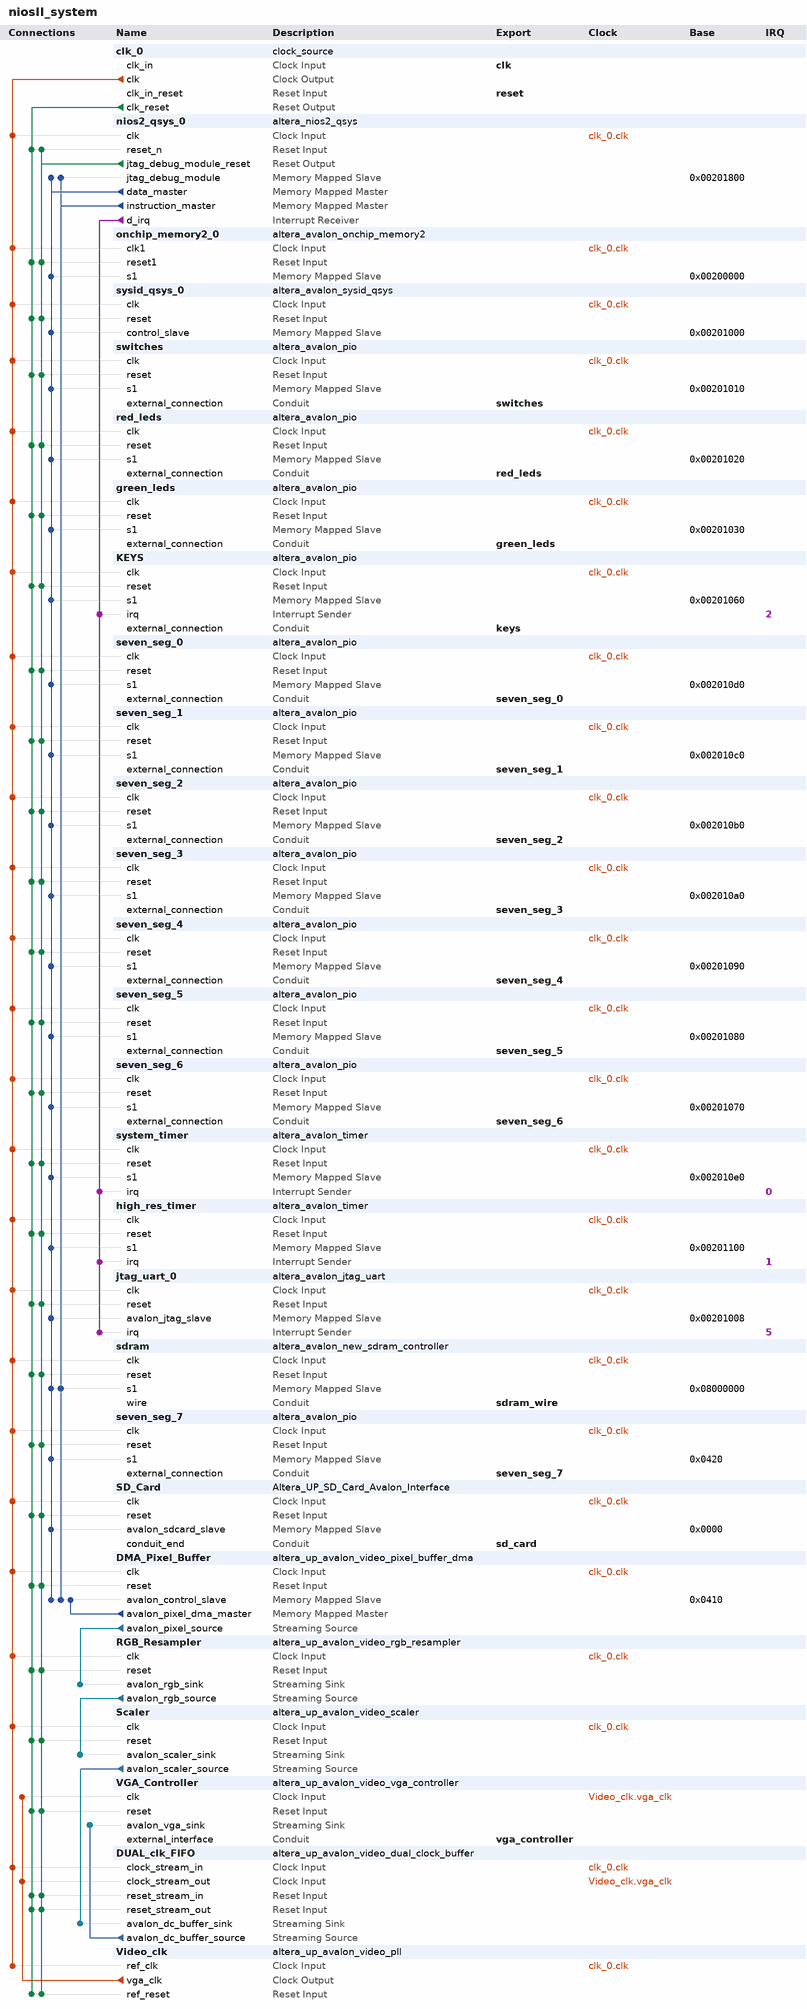
[diagram p0: system contents]
# Platform Designer (Qsys) system niosII_system, Cyclone IV E EP4CE115F29C7
# Parameters at their usual value, and those the tool derives, are not listed.
package require -exact qsys 16.1
create_system niosII_system
set_project_property DEVICE_FAMILY {Cyclone IV E}
set_project_property DEVICE EP4CE115F29C7

add_instance clk_0 clock_source 16.1
set_instance_parameter_value clk_0 clockFrequency 50000000

add_instance nios2_qsys_0 altera_nios2_qsys 16.1
set_instance_parameter_value nios2_qsys_0 breakSlave nios2_qsys_0.jtag_debug_module
set_instance_parameter_value nios2_qsys_0 exceptionSlave sdram.s1
set_instance_parameter_value nios2_qsys_0 icache_size 4096
set_instance_parameter_value nios2_qsys_0 impl Fast
set_instance_parameter_value nios2_qsys_0 mmu_TLBMissExcSlave None
set_instance_parameter_value nios2_qsys_0 resetSlave sdram.s1
set_instance_parameter_value nios2_qsys_0 resetrequest_enabled true

add_instance onchip_memory2_0 altera_avalon_onchip_memory2 16.1
set_instance_parameter_value onchip_memory2_0 dataWidth 32
set_instance_parameter_value onchip_memory2_0 dualPort false
set_instance_parameter_value onchip_memory2_0 initMemContent true
set_instance_parameter_value onchip_memory2_0 initializationFileName onchip_mem.hex
set_instance_parameter_value onchip_memory2_0 memorySize 4096

add_instance sysid_qsys_0 altera_avalon_sysid_qsys 16.1
set_instance_parameter_value sysid_qsys_0 id 16843008

add_instance switches altera_avalon_pio 16.1
set_instance_parameter_value switches direction Input
set_instance_parameter_value switches width 18

add_instance red_leds altera_avalon_pio 16.1
set_instance_parameter_value red_leds direction Output
set_instance_parameter_value red_leds width 18

add_instance green_leds altera_avalon_pio 16.1
set_instance_parameter_value green_leds direction Output
set_instance_parameter_value green_leds width 8

add_instance KEYS altera_avalon_pio 16.1
set_instance_parameter_value KEYS captureEdge true
set_instance_parameter_value KEYS direction Input
set_instance_parameter_value KEYS edgeType FALLING
set_instance_parameter_value KEYS generateIRQ true
set_instance_parameter_value KEYS irqType EDGE
set_instance_parameter_value KEYS width 3

add_instance seven_seg_0 altera_avalon_pio 16.1
set_instance_parameter_value seven_seg_0 direction Output
set_instance_parameter_value seven_seg_0 width 7

add_instance seven_seg_1 altera_avalon_pio 16.1
set_instance_parameter_value seven_seg_1 direction Output
set_instance_parameter_value seven_seg_1 width 7

add_instance seven_seg_2 altera_avalon_pio 16.1
set_instance_parameter_value seven_seg_2 direction Output
set_instance_parameter_value seven_seg_2 width 7

add_instance seven_seg_3 altera_avalon_pio 16.1
set_instance_parameter_value seven_seg_3 direction Output
set_instance_parameter_value seven_seg_3 width 7

add_instance seven_seg_4 altera_avalon_pio 16.1
set_instance_parameter_value seven_seg_4 direction Output
set_instance_parameter_value seven_seg_4 width 7

add_instance seven_seg_5 altera_avalon_pio 16.1
set_instance_parameter_value seven_seg_5 direction Output
set_instance_parameter_value seven_seg_5 width 7

add_instance seven_seg_6 altera_avalon_pio 16.1
set_instance_parameter_value seven_seg_6 direction Output
set_instance_parameter_value seven_seg_6 width 7

add_instance system_timer altera_avalon_timer 16.1
set_instance_parameter_value system_timer period 1
set_instance_parameter_value system_timer periodUnits MSEC

add_instance high_res_timer altera_avalon_timer 16.1
set_instance_parameter_value high_res_timer period 1
set_instance_parameter_value high_res_timer periodUnits USEC

add_instance jtag_uart_0 altera_avalon_jtag_uart 16.1
set_instance_parameter_value jtag_uart_0 simInteractiveOptions NO_INTERACTIVE_WINDOWS

add_instance sdram altera_avalon_new_sdram_controller 16.1
set_instance_parameter_value sdram TAC 5.4
set_instance_parameter_value sdram TRCD 15.0
set_instance_parameter_value sdram TRP 15.0
set_instance_parameter_value sdram casLatency 3
set_instance_parameter_value sdram columnWidth 10
set_instance_parameter_value sdram dataWidth 32
set_instance_parameter_value sdram generateSimulationModel false
set_instance_parameter_value sdram model single_Micron_MT48LC4M32B2_7_chip
set_instance_parameter_value sdram numberOfBanks 4
set_instance_parameter_value sdram numberOfChipSelects 1
set_instance_parameter_value sdram powerUpDelay 100.0
set_instance_parameter_value sdram refreshPeriod 7.8125
set_instance_parameter_value sdram rowWidth 13

add_instance seven_seg_7 altera_avalon_pio 16.1
set_instance_parameter_value seven_seg_7 direction Output
set_instance_parameter_value seven_seg_7 width 7

add_instance SD_Card Altera_UP_SD_Card_Avalon_Interface 16.1

add_instance DMA_Pixel_Buffer altera_up_avalon_video_pixel_buffer_dma 16.1
set_instance_parameter_value DMA_Pixel_Buffer addr_mode X-Y
set_instance_parameter_value DMA_Pixel_Buffer back_start_address 0
set_instance_parameter_value DMA_Pixel_Buffer color_space {16-bit RGB}
set_instance_parameter_value DMA_Pixel_Buffer image_height 240
set_instance_parameter_value DMA_Pixel_Buffer image_width 320
set_instance_parameter_value DMA_Pixel_Buffer start_address 0

add_instance RGB_Resampler altera_up_avalon_video_rgb_resampler 16.1
set_instance_parameter_value RGB_Resampler alpha 1023
set_instance_parameter_value RGB_Resampler input_type {16-bit RGB}
set_instance_parameter_value RGB_Resampler output_type {30-bit RGB}

add_instance Scaler altera_up_avalon_video_scaler 16.1
set_instance_parameter_value Scaler color_bits 10
set_instance_parameter_value Scaler color_planes 3
set_instance_parameter_value Scaler height_scaling 2
set_instance_parameter_value Scaler width_in 320
set_instance_parameter_value Scaler width_scaling 2

add_instance VGA_Controller altera_up_avalon_video_vga_controller 16.1
set_instance_parameter_value VGA_Controller board DE2-115
set_instance_parameter_value VGA_Controller resolution {VGA 640x480}

add_instance DUAL_clk_FIFO altera_up_avalon_video_dual_clock_buffer 16.1
set_instance_parameter_value DUAL_clk_FIFO color_bits 10

add_instance Video_clk altera_up_avalon_video_pll 16.1
set_instance_parameter_value Video_clk camera {5MP Digital Camera}
set_instance_parameter_value Video_clk gui_refclk 50.0
set_instance_parameter_value Video_clk lcd {7" LCD on VEEK-MT and MTL Module}

# connections
add_connection clk_0.clk DMA_Pixel_Buffer.clk clock
add_connection clk_0.clk DUAL_clk_FIFO.clock_stream_in clock
add_connection clk_0.clk green_leds.clk clock
add_connection clk_0.clk high_res_timer.clk clock
add_connection clk_0.clk jtag_uart_0.clk clock
add_connection clk_0.clk KEYS.clk clock
add_connection clk_0.clk nios2_qsys_0.clk clock
add_connection clk_0.clk onchip_memory2_0.clk1 clock
add_connection clk_0.clk red_leds.clk clock
add_connection clk_0.clk RGB_Resampler.clk clock
add_connection clk_0.clk Scaler.clk clock
add_connection clk_0.clk SD_Card.clk clock
add_connection clk_0.clk sdram.clk clock
add_connection clk_0.clk seven_seg_0.clk clock
add_connection clk_0.clk seven_seg_1.clk clock
add_connection clk_0.clk seven_seg_2.clk clock
add_connection clk_0.clk seven_seg_3.clk clock
add_connection clk_0.clk seven_seg_4.clk clock
add_connection clk_0.clk seven_seg_5.clk clock
add_connection clk_0.clk seven_seg_6.clk clock
add_connection clk_0.clk seven_seg_7.clk clock
add_connection clk_0.clk switches.clk clock
add_connection clk_0.clk sysid_qsys_0.clk clock
add_connection clk_0.clk system_timer.clk clock
add_connection clk_0.clk Video_clk.ref_clk clock
add_connection Video_clk.vga_clk DUAL_clk_FIFO.clock_stream_out clock
add_connection Video_clk.vga_clk VGA_Controller.clk clock
add_connection clk_0.clk_reset DMA_Pixel_Buffer.reset reset
add_connection clk_0.clk_reset DUAL_clk_FIFO.reset_stream_in reset
add_connection clk_0.clk_reset DUAL_clk_FIFO.reset_stream_out reset
add_connection clk_0.clk_reset green_leds.reset reset
add_connection clk_0.clk_reset high_res_timer.reset reset
add_connection clk_0.clk_reset jtag_uart_0.reset reset
add_connection clk_0.clk_reset KEYS.reset reset
add_connection clk_0.clk_reset nios2_qsys_0.reset_n reset
add_connection clk_0.clk_reset onchip_memory2_0.reset1 reset
add_connection clk_0.clk_reset red_leds.reset reset
add_connection clk_0.clk_reset RGB_Resampler.reset reset
add_connection clk_0.clk_reset Scaler.reset reset
add_connection clk_0.clk_reset SD_Card.reset reset
add_connection clk_0.clk_reset sdram.reset reset
add_connection clk_0.clk_reset seven_seg_0.reset reset
add_connection clk_0.clk_reset seven_seg_1.reset reset
add_connection clk_0.clk_reset seven_seg_2.reset reset
add_connection clk_0.clk_reset seven_seg_3.reset reset
add_connection clk_0.clk_reset seven_seg_4.reset reset
add_connection clk_0.clk_reset seven_seg_5.reset reset
add_connection clk_0.clk_reset seven_seg_6.reset reset
add_connection clk_0.clk_reset seven_seg_7.reset reset
add_connection clk_0.clk_reset switches.reset reset
add_connection clk_0.clk_reset sysid_qsys_0.reset reset
add_connection clk_0.clk_reset system_timer.reset reset
add_connection clk_0.clk_reset VGA_Controller.reset reset
add_connection clk_0.clk_reset Video_clk.ref_reset reset
add_connection nios2_qsys_0.jtag_debug_module_reset DMA_Pixel_Buffer.reset reset
add_connection nios2_qsys_0.jtag_debug_module_reset DUAL_clk_FIFO.reset_stream_in reset
add_connection nios2_qsys_0.jtag_debug_module_reset DUAL_clk_FIFO.reset_stream_out reset
add_connection nios2_qsys_0.jtag_debug_module_reset green_leds.reset reset
add_connection nios2_qsys_0.jtag_debug_module_reset high_res_timer.reset reset
add_connection nios2_qsys_0.jtag_debug_module_reset jtag_uart_0.reset reset
add_connection nios2_qsys_0.jtag_debug_module_reset KEYS.reset reset
add_connection nios2_qsys_0.jtag_debug_module_reset nios2_qsys_0.reset_n reset
add_connection nios2_qsys_0.jtag_debug_module_reset onchip_memory2_0.reset1 reset
add_connection nios2_qsys_0.jtag_debug_module_reset red_leds.reset reset
add_connection nios2_qsys_0.jtag_debug_module_reset RGB_Resampler.reset reset
add_connection nios2_qsys_0.jtag_debug_module_reset Scaler.reset reset
add_connection nios2_qsys_0.jtag_debug_module_reset SD_Card.reset reset
add_connection nios2_qsys_0.jtag_debug_module_reset sdram.reset reset
add_connection nios2_qsys_0.jtag_debug_module_reset seven_seg_0.reset reset
add_connection nios2_qsys_0.jtag_debug_module_reset seven_seg_1.reset reset
add_connection nios2_qsys_0.jtag_debug_module_reset seven_seg_2.reset reset
add_connection nios2_qsys_0.jtag_debug_module_reset seven_seg_3.reset reset
add_connection nios2_qsys_0.jtag_debug_module_reset seven_seg_4.reset reset
add_connection nios2_qsys_0.jtag_debug_module_reset seven_seg_5.reset reset
add_connection nios2_qsys_0.jtag_debug_module_reset seven_seg_6.reset reset
add_connection nios2_qsys_0.jtag_debug_module_reset seven_seg_7.reset reset
add_connection nios2_qsys_0.jtag_debug_module_reset switches.reset reset
add_connection nios2_qsys_0.jtag_debug_module_reset sysid_qsys_0.reset reset
add_connection nios2_qsys_0.jtag_debug_module_reset system_timer.reset reset
add_connection nios2_qsys_0.jtag_debug_module_reset VGA_Controller.reset reset
add_connection nios2_qsys_0.jtag_debug_module_reset Video_clk.ref_reset reset
add_connection DMA_Pixel_Buffer.avalon_pixel_dma_master DMA_Pixel_Buffer.avalon_control_slave avalon
set_connection_parameter_value DMA_Pixel_Buffer.avalon_pixel_dma_master/DMA_Pixel_Buffer.avalon_control_slave baseAddress 0x0410
add_connection nios2_qsys_0.data_master DMA_Pixel_Buffer.avalon_control_slave avalon
set_connection_parameter_value nios2_qsys_0.data_master/DMA_Pixel_Buffer.avalon_control_slave baseAddress 0x0410
add_connection nios2_qsys_0.data_master green_leds.s1 avalon
set_connection_parameter_value nios2_qsys_0.data_master/green_leds.s1 baseAddress 0x00201030
add_connection nios2_qsys_0.data_master high_res_timer.s1 avalon
set_connection_parameter_value nios2_qsys_0.data_master/high_res_timer.s1 baseAddress 0x00201100
add_connection nios2_qsys_0.data_master jtag_uart_0.avalon_jtag_slave avalon
set_connection_parameter_value nios2_qsys_0.data_master/jtag_uart_0.avalon_jtag_slave baseAddress 0x00201008
add_connection nios2_qsys_0.data_master KEYS.s1 avalon
set_connection_parameter_value nios2_qsys_0.data_master/KEYS.s1 baseAddress 0x00201060
add_connection nios2_qsys_0.data_master nios2_qsys_0.jtag_debug_module avalon
set_connection_parameter_value nios2_qsys_0.data_master/nios2_qsys_0.jtag_debug_module baseAddress 0x00201800
add_connection nios2_qsys_0.data_master onchip_memory2_0.s1 avalon
set_connection_parameter_value nios2_qsys_0.data_master/onchip_memory2_0.s1 baseAddress 0x00200000
add_connection nios2_qsys_0.data_master red_leds.s1 avalon
set_connection_parameter_value nios2_qsys_0.data_master/red_leds.s1 baseAddress 0x00201020
add_connection nios2_qsys_0.data_master SD_Card.avalon_sdcard_slave avalon
set_connection_parameter_value nios2_qsys_0.data_master/SD_Card.avalon_sdcard_slave baseAddress 0x0000
add_connection nios2_qsys_0.data_master sdram.s1 avalon
set_connection_parameter_value nios2_qsys_0.data_master/sdram.s1 baseAddress 0x08000000
add_connection nios2_qsys_0.data_master seven_seg_0.s1 avalon
set_connection_parameter_value nios2_qsys_0.data_master/seven_seg_0.s1 baseAddress 0x002010d0
add_connection nios2_qsys_0.data_master seven_seg_1.s1 avalon
set_connection_parameter_value nios2_qsys_0.data_master/seven_seg_1.s1 baseAddress 0x002010c0
add_connection nios2_qsys_0.data_master seven_seg_2.s1 avalon
set_connection_parameter_value nios2_qsys_0.data_master/seven_seg_2.s1 baseAddress 0x002010b0
add_connection nios2_qsys_0.data_master seven_seg_3.s1 avalon
set_connection_parameter_value nios2_qsys_0.data_master/seven_seg_3.s1 baseAddress 0x002010a0
add_connection nios2_qsys_0.data_master seven_seg_4.s1 avalon
set_connection_parameter_value nios2_qsys_0.data_master/seven_seg_4.s1 baseAddress 0x00201090
add_connection nios2_qsys_0.data_master seven_seg_5.s1 avalon
set_connection_parameter_value nios2_qsys_0.data_master/seven_seg_5.s1 baseAddress 0x00201080
add_connection nios2_qsys_0.data_master seven_seg_6.s1 avalon
set_connection_parameter_value nios2_qsys_0.data_master/seven_seg_6.s1 baseAddress 0x00201070
add_connection nios2_qsys_0.data_master seven_seg_7.s1 avalon
set_connection_parameter_value nios2_qsys_0.data_master/seven_seg_7.s1 baseAddress 0x0420
add_connection nios2_qsys_0.data_master switches.s1 avalon
set_connection_parameter_value nios2_qsys_0.data_master/switches.s1 baseAddress 0x00201010
add_connection nios2_qsys_0.data_master sysid_qsys_0.control_slave avalon
set_connection_parameter_value nios2_qsys_0.data_master/sysid_qsys_0.control_slave baseAddress 0x00201000
add_connection nios2_qsys_0.data_master system_timer.s1 avalon
set_connection_parameter_value nios2_qsys_0.data_master/system_timer.s1 baseAddress 0x002010e0
add_connection nios2_qsys_0.instruction_master DMA_Pixel_Buffer.avalon_control_slave avalon
set_connection_parameter_value nios2_qsys_0.instruction_master/DMA_Pixel_Buffer.avalon_control_slave baseAddress 0x0410
add_connection nios2_qsys_0.instruction_master nios2_qsys_0.jtag_debug_module avalon
set_connection_parameter_value nios2_qsys_0.instruction_master/nios2_qsys_0.jtag_debug_module baseAddress 0x00201800
add_connection nios2_qsys_0.instruction_master sdram.s1 avalon
set_connection_parameter_value nios2_qsys_0.instruction_master/sdram.s1 baseAddress 0x08000000
add_connection DMA_Pixel_Buffer.avalon_pixel_source RGB_Resampler.avalon_rgb_sink avalon_streaming
add_connection DUAL_clk_FIFO.avalon_dc_buffer_source VGA_Controller.avalon_vga_sink avalon_streaming
add_connection RGB_Resampler.avalon_rgb_source Scaler.avalon_scaler_sink avalon_streaming
add_connection Scaler.avalon_scaler_source DUAL_clk_FIFO.avalon_dc_buffer_sink avalon_streaming
add_connection nios2_qsys_0.d_irq high_res_timer.irq interrupt
set_connection_parameter_value nios2_qsys_0.d_irq/high_res_timer.irq irqNumber 1
add_connection nios2_qsys_0.d_irq jtag_uart_0.irq interrupt
set_connection_parameter_value nios2_qsys_0.d_irq/jtag_uart_0.irq irqNumber 5
add_connection nios2_qsys_0.d_irq KEYS.irq interrupt
set_connection_parameter_value nios2_qsys_0.d_irq/KEYS.irq irqNumber 2
add_connection nios2_qsys_0.d_irq system_timer.irq interrupt
set_connection_parameter_value nios2_qsys_0.d_irq/system_timer.irq irqNumber 0

# exported interfaces
add_interface clk clock sink
set_interface_property clk EXPORT_OF clk_0.clk_in
add_interface green_leds conduit end
set_interface_property green_leds EXPORT_OF green_leds.external_connection
add_interface keys conduit end
set_interface_property keys EXPORT_OF KEYS.external_connection
add_interface red_leds conduit end
set_interface_property red_leds EXPORT_OF red_leds.external_connection
add_interface reset reset sink
set_interface_property reset EXPORT_OF clk_0.clk_in_reset
add_interface sd_card conduit end
set_interface_property sd_card EXPORT_OF SD_Card.conduit_end
add_interface sdram_wire conduit end
set_interface_property sdram_wire EXPORT_OF sdram.wire
add_interface seven_seg_0 conduit end
set_interface_property seven_seg_0 EXPORT_OF seven_seg_0.external_connection
add_interface seven_seg_1 conduit end
set_interface_property seven_seg_1 EXPORT_OF seven_seg_1.external_connection
add_interface seven_seg_2 conduit end
set_interface_property seven_seg_2 EXPORT_OF seven_seg_2.external_connection
add_interface seven_seg_3 conduit end
set_interface_property seven_seg_3 EXPORT_OF seven_seg_3.external_connection
add_interface seven_seg_4 conduit end
set_interface_property seven_seg_4 EXPORT_OF seven_seg_4.external_connection
add_interface seven_seg_5 conduit end
set_interface_property seven_seg_5 EXPORT_OF seven_seg_5.external_connection
add_interface seven_seg_6 conduit end
set_interface_property seven_seg_6 EXPORT_OF seven_seg_6.external_connection
add_interface seven_seg_7 conduit end
set_interface_property seven_seg_7 EXPORT_OF seven_seg_7.external_connection
add_interface switches conduit end
set_interface_property switches EXPORT_OF switches.external_connection
add_interface vga_controller conduit end
set_interface_property vga_controller EXPORT_OF VGA_Controller.external_interface

set_interconnect_requirement {$system} qsys_mm.clockCrossingAdapter HANDSHAKE
set_interconnect_requirement {$system} qsys_mm.enableEccProtection FALSE
set_interconnect_requirement {$system} qsys_mm.insertDefaultSlave FALSE
set_interconnect_requirement {$system} qsys_mm.maxAdditionalLatency 1

save_system niosII_system.qsys
